# Altium schematic sheet MOD_ALIMENTACION.SchDoc
size A
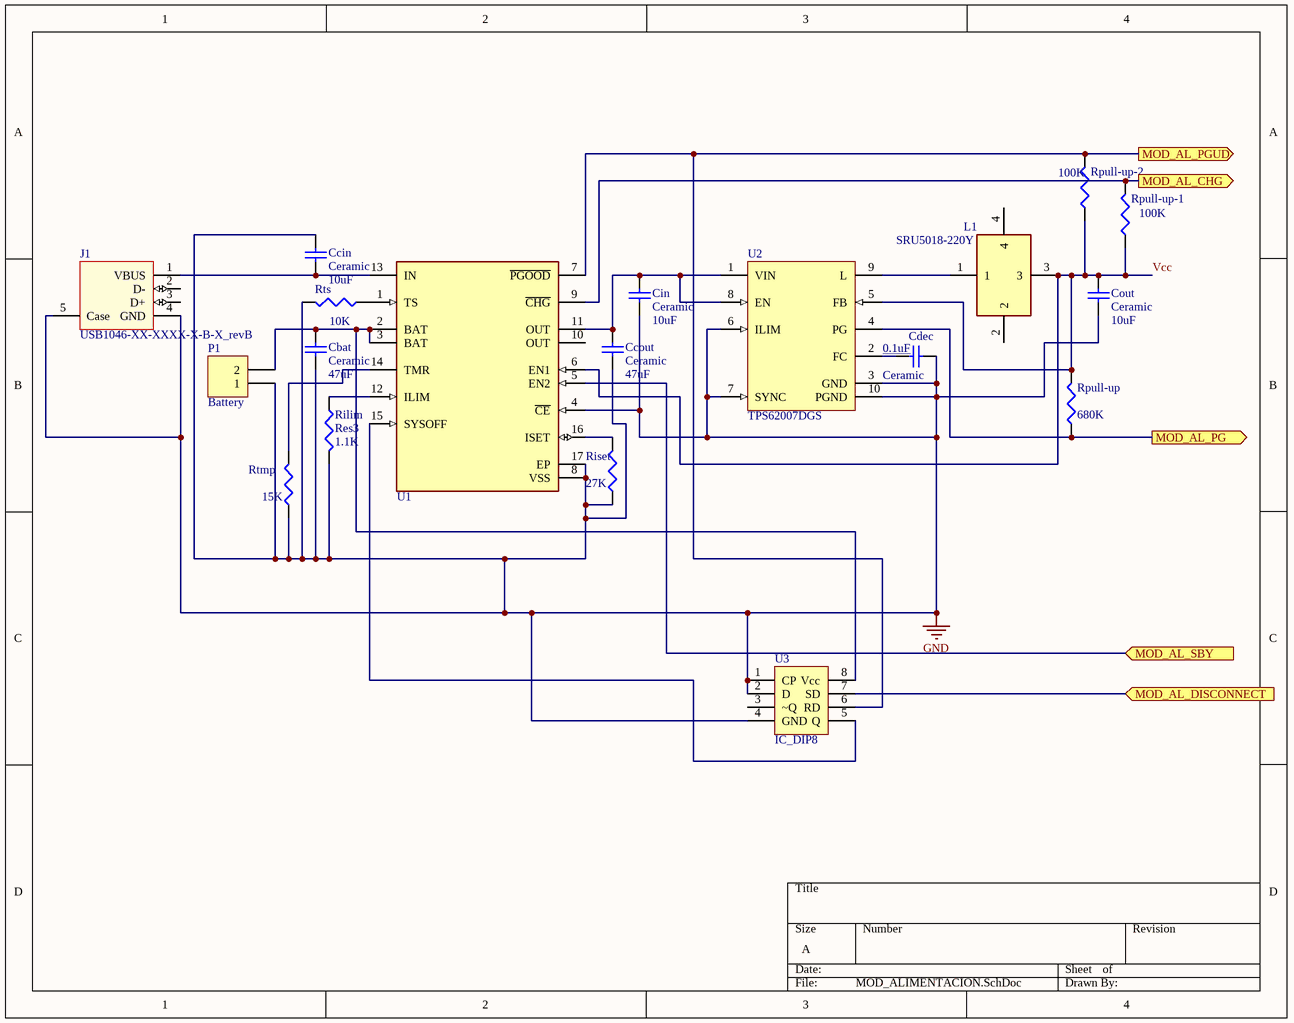
[diagram p0: MOD_ALIMENTACION.SchDoc]

## Parts
Cbat  Ceramic  value 47uF  [RAD-0.3]
Ccin  Ceramic  value 10uF  [RAD-0.3]
Ccout  Ceramic  value 47uF  [RAD-0.3]
Cdec  Ceramic  value 0.1uF  [RAD-0.3]
Cin  Ceramic  value 10uF  [RAD-0.3]
Cout  Ceramic  value 10uF  [RAD-0.3]
J1  USB1046-XX-XXXX-X-B-X_revB  [USB1046-XX-XXXX-X-B-X_revB]
L1  SRU5018-220Y  [SRU5018680Y]
P1  Battery  [HDR1X2]
Rilim  Res3  value 1.1K  [J1-0603]
Riset  value 27K  [J1-0603]
Rpull-up  value 680K  [J1-0603]
Rpull-up-1  value 100K  [J1-0603]
Rpull-up-2  value 100K  [J1-0603]
Rtmp  value 15K  [J1-0603]
Rts  value 10K  [J1-0603]
U1  BQ24075RGTT  (value not drawn)
U2  TPS62007DGS  [DGS10_L]
U3  IC_DIP8  [DIP8]

## Ports
MOD_AL_CHG (out), MOD_AL_DISCONNECT (in), MOD_AL_PG (out), MOD_AL_PGUD (out), MOD_AL_SBY (in)

## Nets
GND: Cbat.2 Ccin.2 Ccout.1 Cdec.2 Cin.1 Cout.1 J1.4(GND) J1.5(Case) P1.1 Rilim.2 Riset.1 Rtmp.1 Rts.2 U1.4(~{CE}) U1.8(VSS) U1.17(EP) U2.3(GND) U2.6(ILIM) U2.7(SYNC) U2.10(PGND) U3.1(CP) U3.2(D) U3.4(GND)
MOD_AL_CHG: Rpull-up-1.2 U1.9(~{CHG}) ; port MOD_AL_CHG
MOD_AL_DISCONNECT: U3.7(SD) ; port MOD_AL_DISCONNECT
MOD_AL_PG: Rpull-up.1 U2.4(PG) ; port MOD_AL_PG
MOD_AL_PGUD: Rpull-up-2.2 U1.7(~{PGOOD}) U3.6(RD) ; port MOD_AL_PGUD
MOD_AL_SBY: U1.5(EN2) ; port MOD_AL_SBY
Vcc: Cout.2 L1.3 Rpull-up.2 Rpull-up-1.1 Rpull-up-2.1 U1.6(EN1) U2.5(FB)
NetCbat_1: Cbat.1 P1.2 U1.2(BAT) U1.3(BAT) U3.8(Vcc)
NetCcin_1: Ccin.1 J1.1(VBUS) U1.13(IN)
NetCcout_2: Ccout.2 Cin.2 U1.11(OUT) U2.1(VIN) U2.8(EN)
NetCdec_1: Cdec.1 U2.2(FC)
NetL1_1: L1.1 U2.9(L)
NetRilim_1: Rilim.1 U1.12(ILIM)
NetRiset_2: Riset.2 U1.16(ISET)
NetRtmp_2: Rtmp.2 U1.14(TMR)
NetRts_1: Rts.1 U1.1(TS)
NetU1_15: U1.15(SYSOFF) U3.5(Q)

Not connected (* = marked no-connect by the designer): J1 2(D-) 3(D+); L1 2 4; U1 10(OUT); U3 3(~Q)

## Library data of the parts
Cbat Ccin Ccout Cdec Cin Cout = Cap: Capacitor; Published: 8-Jun-2000; LatestRevisionDate: 17-Jul-2002; LatestRevisionNote: Re-released for DXP Platform.; PackageReference: RAD-0.3; Publisher: Altium Limited; PackageDescription: Radial Cap, Thru-Hole; 2 Leads; 0.3 in Pin Spacing
J1 = USB1046-XX-XXXX-X-B-X_revB: USB Receptecal, Type A, 4 Pin, Top Mount, SMT, Horizontal, with Kinked Shell Stakes
L1 = SRU5018-220Y: Inductor; Manufacturer_Name: Bourns; Datasheet Link: https://www.bourns.com/docs/Product-Datasheets/SRU5018.pdf; Height: 2mm; Manufacturer_Part_Number: SRU5018-220Y; Mouser Part Number: 652-SRU5018-220Y; Mouser Price/Stock: https://www.mouser.co.uk/ProductDetail/Bourns/SRU5018-220Y?qs=q9ZR8LvBB%2Fu2CA7Fi%252BOvOg%3D%3D; Arrow Part Number: SRU5018-220Y; Arrow Price/Stock: https://www.arrow.com/en/products/sru5018-220y/bourns
P1 = Header 2: Header, 2-Pin; LatestRevisionDate: 17-Jul-2002; LatestRevisionNote: Re-released for DXP Platform.; Publisher: Altium Limited
Rilim Riset Rpull-up Rpull-up-1 Rpull-up-2 Rtmp Rts = Res3: Resistor; Published: 8-Jun-2000; LatestRevisionDate: 29-May-2009; LatestRevisionNote: IPC-7351 Footprint Added.; PackageReference: J1-0603; Publisher: Altium Limited; PackageDescription: Chip Resistor
U2 = TPS62007DGS: Buck Step-Down Regulator with 2 V to 5.5 V Input and 3.3 V Output, -40 to 85 degC, 10-Pin MSOP (DGS), Green (RoHS & no Sb/Br); Manufacturer: Texas Instruments; Iq(Typ)(mA): 0.05; Vin(Min)(V): 2; Vout(Max)(V): 3.3; Duty Cycle(Max)(%): 100; Vin(Max)(V): 5.5; Rating: Catalog; Synchronous Rectification: TRUE; Regulated Outputs(#): 1; Switch Current Limit(Typ)(A): 1.6; Iout(Max)(A): 0.6; Preset Vout(V): 3.3; Eco-Plan: Green (RoHS & no Sb/Br); PartNumber: TPS62007DGS; SubFamily: Step-Down Regulator; ComponentLink1Description: Datasheet; ComponentLink2Description: Package Specification; Vout(Min)(V): 3.3; DatasheetVersion: SLVS294E; ComponentLink1URL: http://www.ti.com/general/docs/lit/getliterature.tsp?genericPartNumber=TPS62007&fileType=pdf; Code_JEDEC: MO-187-BA; ComponentLink2URL: http://www.ti.com/litv/pdf/mpds373; PackageReference: DGS10; PackageVersion: revC, Feb-2004; Mounting Technology: Surface Mount; Topology: Buck; PackageDescription: 10-Pin Thin Shrink Small Outline Package 0.5 mm Pitch